# Altium schematic sheet Magnetic.SchDoc
size A4
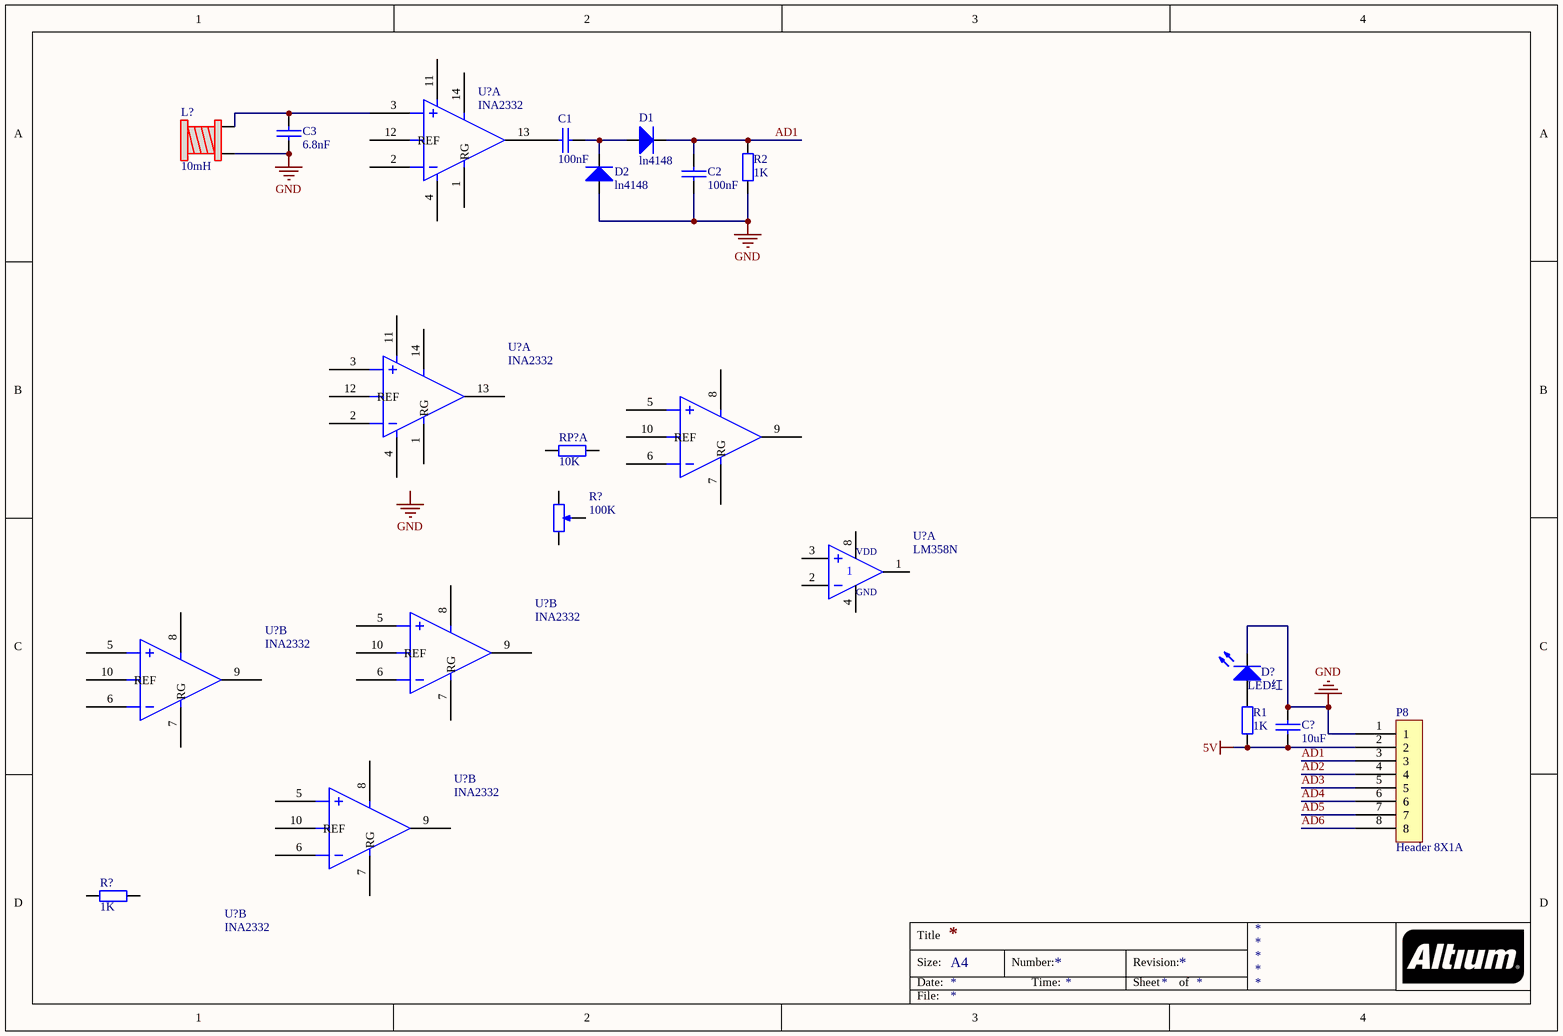
[diagram p0: Magnetic.SchDoc]

## Parts
(Parts that share a designator on the sheet are numbered #1, #2 ... from top to bottom, then left to right.)
C1  100nF  [0603C]
C2  100nF  [0603C]
C3  6.8nF  [0603C]
C?  10uF  [0603C]
D1  ln4148  [SOD-523(0603)]
D2  ln4148  [SOD-523(0603)]
D?  LED红  [0603LED_红]
L?  10mH  [6X8mm电感]
P8  Header 8X1A  [XH2.54_8P]
R1  1K  [0603R]
R2  1K  [0603R]
R?#1  100K  [3362P]
R?#2  1K  [0603R]
RP?  10K  [RN8-0603]  (part A of 4)
U?#1  INA2332  [TSSOP14]  (part A of 2)
U?#2  INA2332  [TSSOP14]  (part A of 2)
U?#3  INA2332  [TSSOP14]  (part B of 2)
U?#4  LM358N  (part A of 2)
U?#5  INA2332  [TSSOP14]  (part B of 2)
U?#6  INA2332  [TSSOP14]  (part B of 2)
U?#7  INA2332  [TSSOP14]  (part B of 2)

## Nets
5V: C?.2 P8.2 R1.1
GND: C2.1 C3.2 C?.1 D2.1 D?.2 L?.1 P8.1 R2.1
AD1: C2.2 D1.2 P8.3 R2.2
AD2: P8.4
AD3: P8.5
AD4: P8.6
AD5: P8.7
AD6: P8.8
NetC1_1: C1.1 U?#1.13
NetC1_2: C1.2 D1.1 D2.2
NetC3_1: C3.1 L?.2 U?#1.3
NetD?_1: D?.1 R1.2

Not connected (* = marked no-connect by the designer): R?#1 1(TOP) 2(TAP) 3(BOT); R?#2 1 2; RP? 1 8; U?#1 1(RG) 2 4 11 12(REF) 14(SHDN); U?#2 1(RG) 2 3 4 11 12(REF) 13 14(SHDN); U?#3 5 6 7(RG) 8(SHDN) 9 10(REF); U?#4 1(OUT) 2(IN-) 3(IN+) 4(GND) 8(VDD); U?#5 5 6 7(RG) 8(SHDN) 9 10(REF); U?#6 5 6 7(RG) 8(SHDN) 9 10(REF); U?#7 5 6 7(RG) 8(SHDN) 9 10(REF)

## Notes on the sheet
- Labels drawn without touching a wire or pin: GND
- Title
- Size:
- Date:
- A4
- Number:
- Time:
- Revision:
- Sheet
- of
- File:

## Library data of the parts
C1 C2 C? = Capacitor
C3 = 6.8μF: Capacitor
D1 D2 = Diode: Typical INFRARED GaAs doide
D? = LED: Typical INFRARED GaAs LED
L? = Inductor_1
P8 = Header 8X1A: Header, 4-Pin, Dual row; LatestRevisionDate: 17-Jul-2002; LatestRevisionNote: Re-released for DXP Platform.; Publisher: Altium Limited
R1 R2 R?#2 = Res: Resistor
R?#1 = RPot: Potentiometer
RP? = Res-Pack2
U?#1-U?#3 U?#5-U?#7 = INA2332_1
U?#4 = LM358N: Dual Low-Power Operational Amplifier